# Altium schematic sheet Connectors.SchDoc
size A3; DocumentNumber: 3; SheetNumber: 3; SheetTotal: 4; SheetSize: A3
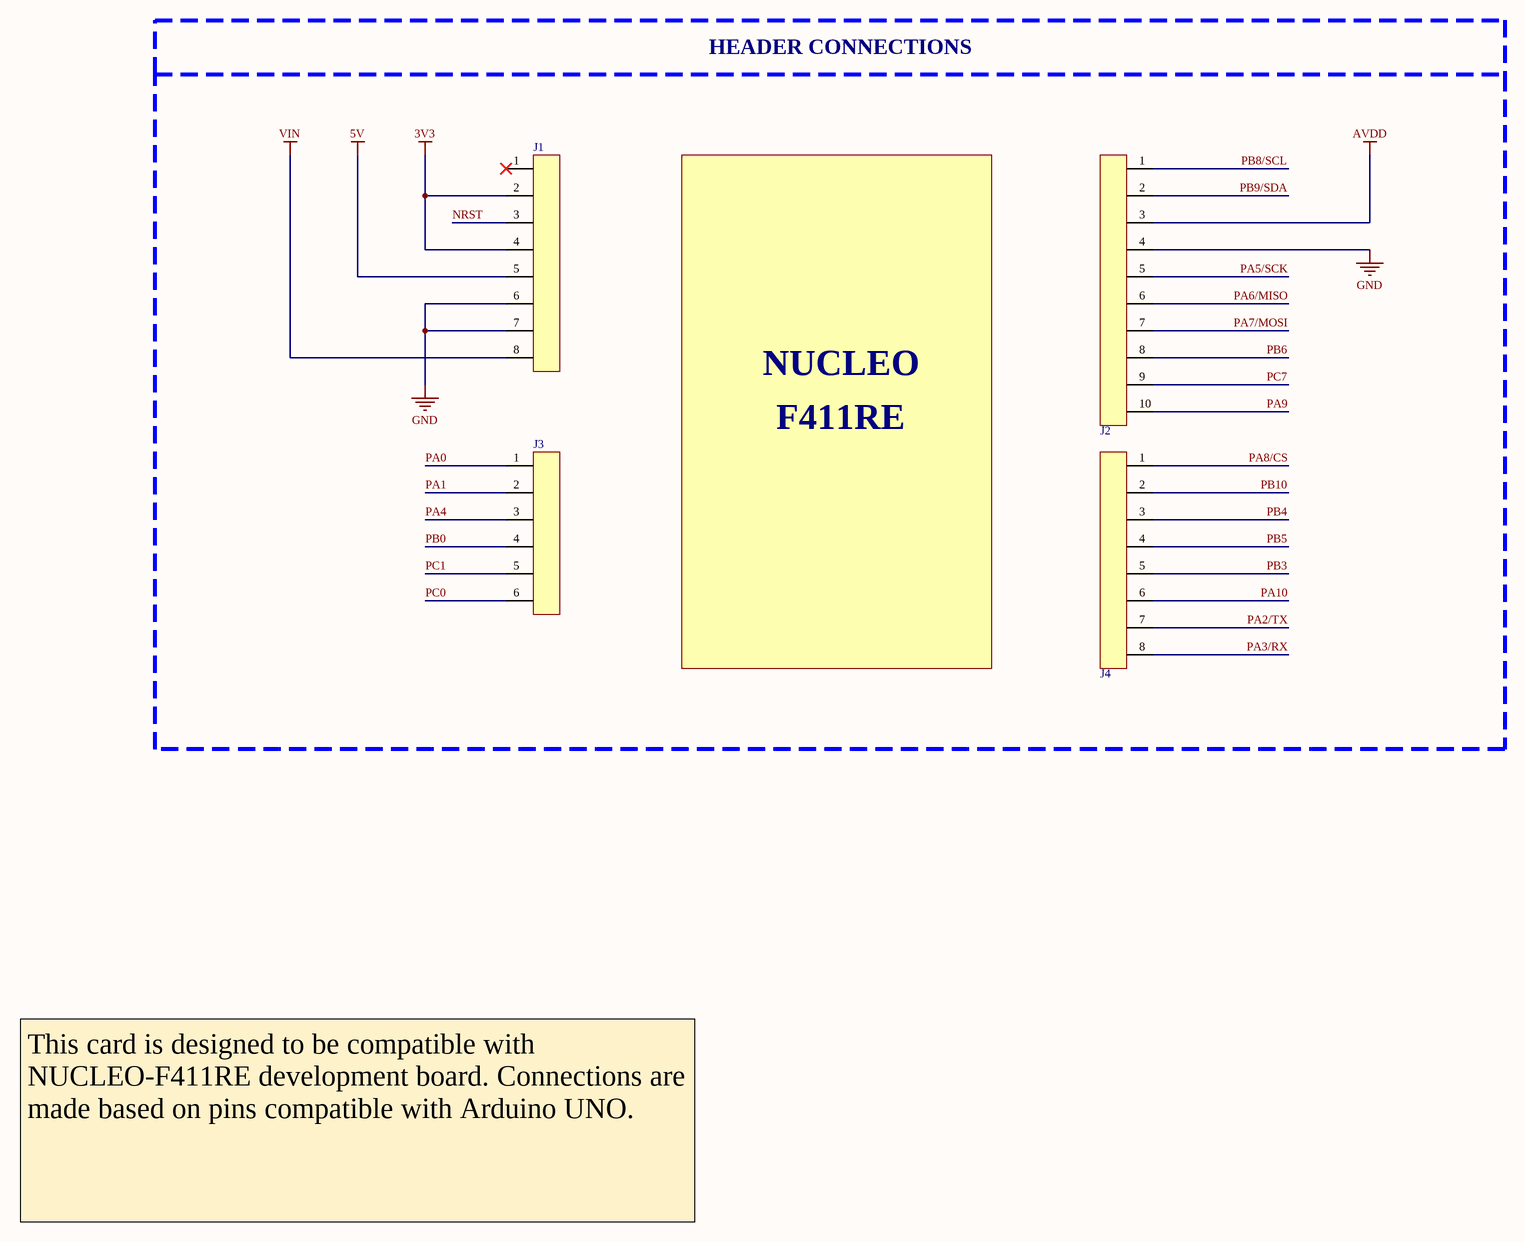
[diagram p0: Connectors.SchDoc]

## Parts
J1  PPTC081LFBN-RC  [8x1 Female Header 2.54mm]  (value not drawn)
J2  PPTC101LFBN-RC  [10x1 Female Header 2.54mm]  (value not drawn)
J3  PPTC061LFBN-RC  [6x1 Female Header 2.54mm]  (value not drawn)
J4  PPTC081LFBN-RC  [8x1 Female Header 2.54mm]  (value not drawn)

## Nets
3V3: J1.2 J1.4
5V: J1.5
AVDD: J2.3
GND: J1.6 J1.7 J2.4
VIN: J1.8
NRST: J1.3
PA0: J3.1
PA1: J3.2
PA2/TX: J4.7
PA3/RX: J4.8
PA4: J3.3
PA5/SCK: J2.5
PA6/MISO: J2.6
PA7/MOSI: J2.7
PA8/CS: J4.1
PA9: J2.10
PA10: J4.6
PB0: J3.4
PB3: J4.5
PB4: J4.3
PB5: J4.4
PB6: J2.8
PB8/SCL: J2.1
PB9/SDA: J2.2
PB10: J4.2
PC0: J3.6
PC1: J3.5
PC7: J2.9

Not connected (* = marked no-connect by the designer): J1 1*

## Notes on the sheet
- HEADER CONNECTIONS
- NUCLEO
- F411RE
- This card is designed to be compatible with NUCLEO-F411RE development board. Connections are made based on pins compatible with Arduino UNO.
- DOSYA ADI / FILE NAME
- TANIM / DESCRIPTION
- HAZIRLAYAN / PREPARED BY
- YAYIN TARİHİ / REL. DATE
- BOYUT / SIZE
- SAYFA / SHEET
- /

## Library data of the parts
J1 J4 = 8x1 Female Header 2.54mm: Female, 8C, Straight, .100"CC; 3.20mm Tail, No Mt. 100u" Tin; PBT, Phos Bronze, 105 C; Manufacturer: Sullins; Designed By: Aslı Kurt; Supplier 1: Digikey; Manufacturer Part Number: PPTC081LFBN-RC; RoHS: Yes; Category: Connectors; Stock 1: 14321; Pricing 1: 1=0,66, 10=0,571, 400=0,42998, 800=0,36855, 1200=0,33783, 5200=0,29689, 10000=0,2925 (USD); Contact Material: 150ConductorMaterial; Housing Material: 4239ConductorMaterial; Length: 20.8mm; Width: 2.5mm; Height: 8.5mm; Lead Free: 5697LeadFree; ComponentLink1URL: https://media.digikey.com/pdf/Data%20Sheets/Sullins%20PDFs/Female_Headers.100_DS.pdf?src-supplier=Digikey; ComponentLink1Description: https://media.digikey.com/pdf/Data%20Sheets/Sullins%20PDFs/Female_Headers.100_DS.pdf?src-supplier=Digikey; ComponentLink2URL: https://datasheet.octopart.com/PPTC081LFBN-RC-Sullins-datasheet-41308905.pdf?src-supplier=Future+Electronics; ComponentLink2Description: https://datasheet.octopart.com/PPTC081LFBN-RC-Sullins-datasheet-41308905.pdf?src-supplier=Future+Electronics; ComponentLink3URL: http://www.sullinscorp.com/catalogs/78_Page80-81_HEADER_.100_2.54mm_FEMALE.pdf?src-supplier=Future+Electronics; ComponentLink3Description: http://www.sullinscorp.com/catalogs/78_Page80-81_HEADER_.100_2.54mm_FEMALE.pdf?src-supplier=Future+Electronics; Supplier Part Number 1: S7006-ND
J2 = 10x1 Female Header 2.54mm: 10 Position Single Row 2.54 mm Pitch Vertical Through Hole Socket Header; Manufacturer: Sullins; Designed By: Aslı Kurt; Supplier 1: Digikey; Manufacturer Part Number: PPTC101LFBN-RC; RoHS: Yes; Category: Connectors; Stock 1: 8769; Pricing 1: 1=0,66, 10=0,557, 320=0,455, 640=0,4095, 960=0,364, 5120=0,325 (USD); ComponentLink1URL: https://media.digikey.com/pdf/Data%20Sheets/Sullins%20PDFs/Female_Headers.100_DS.pdf?src-supplier=Digikey; ComponentLink1Description: https://media.digikey.com/pdf/Data%20Sheets/Sullins%20PDFs/Female_Headers.100_DS.pdf?src-supplier=Digikey; Supplier Part Number 1: S7008-ND
J3 = 6x1 Female Header 2.54mm: Female, 6 C, Straight, .100"CC; 3.20mm Tail, No Mt. 100u" Tin; PBT, Phos Bronze, 105 C; Manufacturer: Sullins; Designed By: Aslı Kurt; Supplier 1: Digikey; Manufacturer Part Number: PPTC061LFBN-RC; RoHS: Yes; Category: Connectors; Stock 1: 8306; Pricing 1: 1=0,52, 10=0,454, 80=0,37463, 440=0,32577, 1000=0,26877, 5000=0,23619, 10000=0,2327 (USD); ComponentLink1URL: https://media.digikey.com/pdf/Data%20Sheets/Sullins%20PDFs/Female_Headers.100_DS.pdf?src-supplier=Digikey; ComponentLink1Description: https://media.digikey.com/pdf/Data%20Sheets/Sullins%20PDFs/Female_Headers.100_DS.pdf?src-supplier=Digikey; ComponentLink2URL: https://datasheet.octopart.com/PPTC061LFBN-RC-Sullins-datasheet-41308905.pdf?src-supplier=Future+Electronics; ComponentLink2Description: https://datasheet.octopart.com/PPTC061LFBN-RC-Sullins-datasheet-41308905.pdf?src-supplier=Future+Electronics; ComponentLink3URL: http://www.sullinscorp.com/catalogs/78_Page80-81_HEADER_.100_2.54mm_FEMALE.pdf?src-supplier=Future+Electronics; ComponentLink3Description: http://www.sullinscorp.com/catalogs/78_Page80-81_HEADER_.100_2.54mm_FEMALE.pdf?src-supplier=Future+Electronics; Supplier Part Number 1: S7004-ND